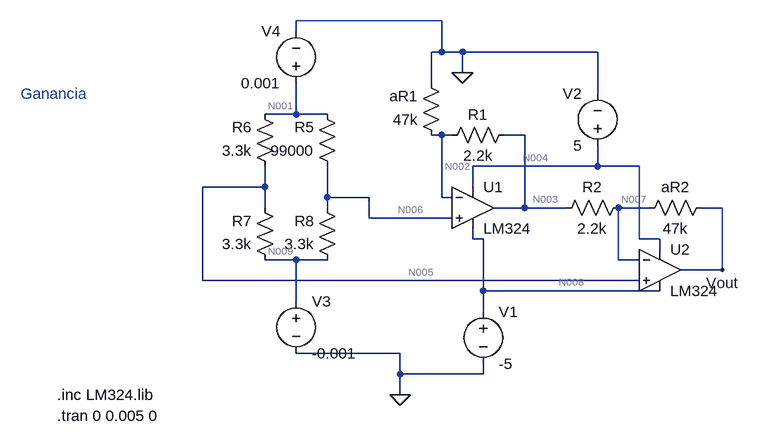
[diagram p0: schematic circuito2.1.asc]
circuito2.1.asc, the LTspice schematic file:
Version 4
SHEET 1 880 680
WIRE 144 -144 -80 -144
WIRE -80 -128 -80 -144
WIRE 144 -96 144 -144
WIRE 144 -96 128 -96
WIRE 176 -96 144 -96
WIRE 384 -96 176 -96
WIRE 176 -64 176 -96
WIRE 128 -48 128 -96
WIRE 384 -32 384 -96
WIRE -80 0 -80 -48
WIRE -80 0 -128 0
WIRE -32 0 -80 0
WIRE 144 32 128 32
WIRE 160 32 144 32
WIRE 272 32 240 32
WIRE 384 80 384 48
WIRE 384 80 192 80
WIRE 448 80 384 80
WIRE -128 112 -128 80
WIRE -128 112 -224 112
WIRE 192 112 192 80
WIRE -32 128 -32 80
WIRE 32 128 -32 128
WIRE 144 128 144 32
WIRE 160 128 144 128
WIRE -128 144 -128 112
WIRE -32 144 -32 128
WIRE 272 144 272 32
WIRE 272 144 224 144
WIRE 336 144 272 144
WIRE 464 144 416 144
WIRE 576 144 544 144
WIRE 32 160 32 128
WIRE 160 160 32 160
WIRE 192 192 192 176
WIRE 208 192 192 192
WIRE 448 192 448 80
WIRE 480 192 448 192
WIRE 480 208 480 192
WIRE -80 224 -128 224
WIRE -32 224 -80 224
WIRE 416 224 416 144
WIRE 448 224 416 224
WIRE 576 240 576 144
WIRE 576 240 512 240
WIRE -224 256 -224 112
WIRE 448 256 -224 256
WIRE 208 272 208 192
WIRE 480 272 208 272
WIRE -80 288 -80 224
WIRE 208 304 208 272
WIRE 80 368 -80 368
WIRE 80 400 80 368
WIRE 208 400 208 384
WIRE 208 400 80 400
WIRE 80 432 80 400
FLAG 80 432 0
FLAG 176 -64 0
FLAG 576 240 Vout
SYMBOL opamp2 192 80 R0
SYMATTR InstName U1
SYMATTR Value LM324
SYMBOL res 256 16 R90
WINDOW 0 0 56 VBottom 2
WINDOW 3 32 56 VTop 2
SYMATTR InstName R1
SYMATTR Value 2.2k
SYMBOL res 432 128 R90
WINDOW 0 0 56 VBottom 2
WINDOW 3 32 56 VTop 2
SYMATTR InstName R2
SYMATTR Value 2.2k
SYMBOL res 560 128 R90
WINDOW 0 0 56 VBottom 2
WINDOW 3 32 56 VTop 2
SYMATTR InstName aR2
SYMATTR Value 47k
SYMBOL res 144 48 R180
WINDOW 0 36 76 Left 2
WINDOW 3 36 40 Left 2
SYMATTR InstName aR1
SYMATTR Value 47k
SYMBOL res -16 96 R180
WINDOW 0 36 76 Left 2
WINDOW 3 36 40 Left 2
SYMATTR InstName R5
SYMATTR Value 99000
SYMBOL res -112 96 R180
WINDOW 0 36 76 Left 2
WINDOW 3 36 40 Left 2
SYMATTR InstName R6
SYMATTR Value 3.3k
SYMBOL res -112 240 R180
WINDOW 0 36 76 Left 2
WINDOW 3 36 40 Left 2
SYMATTR InstName R7
SYMATTR Value 3.3k
SYMBOL res -16 240 R180
WINDOW 0 36 76 Left 2
WINDOW 3 36 40 Left 2
SYMATTR InstName R8
SYMATTR Value 3.3k
SYMBOL voltage 208 288 R0
WINDOW 123 0 0 Left 0
WINDOW 39 0 0 Left 0
SYMATTR InstName V1
SYMATTR Value -5
SYMBOL voltage 384 64 R180
WINDOW 0 24 96 Left 2
WINDOW 3 24 16 Left 2
WINDOW 123 0 0 Left 0
WINDOW 39 0 0 Left 0
SYMATTR InstName V2
SYMATTR Value 5
SYMBOL OpAmps\\opamp2 480 176 R0
SYMATTR InstName U2
SYMATTR Value LM324
SYMBOL voltage -80 272 R0
WINDOW 123 0 0 Left 0
WINDOW 39 0 0 Left 0
SYMATTR InstName V3
SYMATTR Value -0.001
SYMBOL voltage -80 -32 R180
WINDOW 0 24 96 Left 2
WINDOW 3 24 16 Left 2
WINDOW 123 0 0 Left 0
WINDOW 39 0 0 Left 0
SYMATTR InstName V4
SYMATTR Value 0.001
TEXT -448 432 Left 2 !.inc LM324.lib
TEXT -448 464 Left 2 !.tran 0 0.005 0
TEXT -504 -32 Left 2 ;Ganancia

The netlist it stands for:
* circuito2.1.asc
XU1 N006 N002 N004 N008 N003 LM324  ; pins In+ In- V+ V- OUT
R1 N003 N002 2.2k
R2 N007 N003 2.2k
R§aR2 Vout N007 47k
R§aR1 N002 0 47k
R5 N006 N001 99000
R6 N005 N001 3.3k
R7 N009 N005 3.3k
R8 N009 N006 3.3k
V1 N008 0 -5
V2 N004 0 5
XU2 N005 N007 N004 N008 Vout LM324  ; pins In+ In- V+ V- OUT
V3 N009 0 -0.001
V4 N001 0 0.001
.inc LM324.lib
.tran 0 0.005 0
* Ganancia
.backanno
.end

* Results of the author's LTspice run, read from the files saved beside the schematic
* Operating Point, zero values left out:
*   V(n003) = -991.7 µV
*   V(n008) = -5 V
*   V(n004) = 5 V
*   V(n002) = -905.4 µV
*   V(n006) = -871.8 µV
*   V(n007) = -980.7 nV
*   V(vout) = 20.23 mV
*   V(n001) = 1 mV
*   V(n005) = 32.88 µV
*   V(n009) = -1 mV
*   I(R8) = -38.84 nA
*   I(R7) = -313 nA
*   I(R6) = -293.1 nA
*   I(R5) = -18.91 nA
*   I(Ar1) = -19.26 nA
*   I(Ar2) = 430.4 nA
*   I(R2) = 450.3 nA
*   I(R1) = -39.21 nA
*   I(V4) = -312 nA
*   I(V3) = 351.8 nA
*   I(V2) = -679.9 µA
*   I(V1) = 679.8 µA
*   Ix(u1:1) = -19.93 nA
*   Ix(u1:2) = -19.94 nA
*   Ix(u1:3) = 340 µA
*   Ix(u1:4) = -339.9 µA
*   Ix(u1:5) = 489.5 nA
*   Ix(u2:1) = -19.93 nA
*   Ix(u2:2) = -19.94 nA
*   Ix(u2:3) = 340 µA
*   Ix(u2:4) = -339.9 µA
*   Ix(u2:5) = -430.4 nA